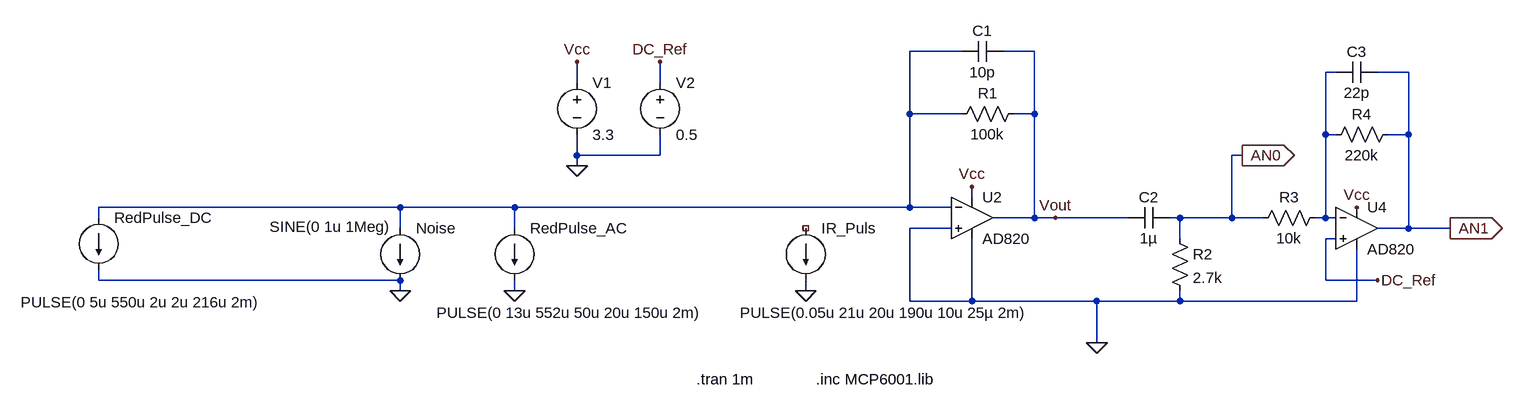
[diagram p0: schematic Verstärkerstufe.asc]
Verstärkerstufe.asc, the LTspice schematic file:
Version 4
SHEET 1 1632 680
WIRE 224 -64 144 -64
WIRE 336 -64 288 -64
WIRE 800 -32 784 -32
WIRE 912 -32 864 -32
WIRE -368 -16 -368 -48
WIRE -240 -16 -240 -48
WIRE 144 32 144 -64
WIRE 224 32 144 32
WIRE 336 32 336 -64
WIRE 336 32 304 32
WIRE 784 64 784 -32
WIRE 800 64 784 64
WIRE 912 64 912 -32
WIRE 912 64 880 64
WIRE -368 96 -368 64
WIRE -240 96 -240 64
WIRE -240 96 -368 96
WIRE 656 96 640 96
WIRE -368 112 -368 96
WIRE 240 160 240 144
WIRE -640 176 -1104 176
WIRE -464 176 -640 176
WIRE 144 176 144 32
WIRE 144 176 -464 176
WIRE 208 176 144 176
WIRE -1104 192 -1104 176
WIRE 336 192 336 32
WIRE 336 192 272 192
WIRE 368 192 336 192
WIRE 480 192 368 192
WIRE 560 192 544 192
WIRE 640 192 640 96
WIRE 640 192 560 192
WIRE 688 192 640 192
WIRE 784 192 784 64
WIRE 784 192 768 192
WIRE 800 192 784 192
WIRE -640 208 -640 176
WIRE -464 208 -464 176
WIRE 208 208 144 208
WIRE 912 208 912 64
WIRE 912 208 864 208
WIRE 976 208 912 208
WIRE 560 224 560 192
WIRE 800 224 784 224
WIRE -1104 288 -1104 272
WIRE -640 288 -1104 288
WIRE 784 288 784 224
WIRE 864 288 784 288
WIRE -640 304 -640 288
WIRE -464 304 -464 288
WIRE -16 304 -16 288
WIRE 144 320 144 208
WIRE 240 320 240 224
WIRE 240 320 144 320
WIRE 432 320 240 320
WIRE 560 320 560 304
WIRE 560 320 432 320
WIRE 832 320 832 240
WIRE 832 320 560 320
WIRE 432 384 432 320
FLAG -368 112 0
FLAG -368 -48 Vcc
FLAG 240 144 Vcc
FLAG -464 304 0
FLAG -16 304 0
FLAG 368 192 Vout
FLAG -640 304 0
FLAG 432 384 0
FLAG 832 176 Vcc
FLAG 976 208 AN1
IOPIN 976 208 Out
FLAG 656 96 AN0
IOPIN 656 96 Out
FLAG -240 -48 DC_Ref
FLAG 864 288 DC_Ref
SYMBOL voltage -368 -32 R0
WINDOW 123 0 0 Left 0
WINDOW 39 0 0 Left 0
SYMATTR InstName V1
SYMATTR Value 3.3
SYMBOL res 320 16 R90
WINDOW 0 0 56 VBottom 2
WINDOW 3 32 56 VTop 2
SYMATTR InstName R1
SYMATTR Value 100k
SYMBOL current -16 208 R0
WINDOW 123 0 0 Left 0
WINDOW 39 0 0 Left 0
WINDOW 3 -101 130 Left 2
SYMATTR Value PULSE(0.05u 21u 20u 190u 10u 25µ 2m)
SYMATTR InstName IR_Puls
SYMBOL current -464 208 R0
WINDOW 3 -120 130 Left 2
WINDOW 123 0 0 Left 0
WINDOW 39 0 0 Left 0
SYMATTR Value PULSE(0 13u 552u 50u 20u 150u 2m)
SYMATTR InstName RedPulse_AC
SYMBOL current -640 208 R0
WINDOW 3 -201 -2 Left 2
WINDOW 123 24 108 Left 2
WINDOW 39 0 0 Left 0
SYMATTR Value SINE(0 1u 1Meg)
SYMATTR InstName Noise
SYMBOL cap 544 176 R90
WINDOW 0 0 32 VBottom 2
WINDOW 3 32 32 VTop 2
SYMATTR InstName C2
SYMATTR Value 1µ
SYMBOL res 544 208 R0
SYMATTR InstName R2
SYMATTR Value 2.7k
SYMBOL res 784 176 R90
WINDOW 0 0 56 VBottom 2
WINDOW 3 32 56 VTop 2
SYMATTR InstName R3
SYMATTR Value 10k
SYMBOL res 896 48 R90
WINDOW 0 0 56 VBottom 2
WINDOW 3 32 56 VTop 2
SYMATTR InstName R4
SYMATTR Value 220k
SYMBOL cap 864 -48 R90
WINDOW 0 0 32 VBottom 2
WINDOW 3 32 32 VTop 2
SYMATTR InstName C3
SYMATTR Value 22p
SYMBOL voltage -240 -32 R0
WINDOW 123 0 0 Left 0
WINDOW 39 0 0 Left 0
SYMATTR InstName V2
SYMATTR Value 0.5
SYMBOL cap 224 -48 R270
WINDOW 0 32 32 VTop 2
WINDOW 3 0 32 VBottom 2
SYMATTR InstName C1
SYMATTR Value 10p
SYMBOL OpAmps\\AD820 240 128 R0
SYMATTR InstName U2
SYMBOL OpAmps\\AD820 832 144 R0
SYMATTR InstName U4
SYMBOL current -1104 192 R0
WINDOW 3 -120 130 Left 2
WINDOW 123 0 0 Left 0
WINDOW 39 0 0 Left 0
SYMATTR Value PULSE(0 5u 550u 2u 2u 216u 2m)
SYMATTR InstName RedPulse_DC
TEXT -184 440 Left 2 !.tran 1m
TEXT 0 440 Left 2 !.inc MCP6001.lib

The netlist it stands for:
* Verstärkerstufe.asc
V1 Vcc 0 3.3
R1 Vout N001 100k
IR_Puls NC_01 0 PULSE(0.05u 21u 20u 190u 10u 25µ 2m)
I§RedPulse_AC N001 0 PULSE(0 13u 552u 50u 20u 150u 2m)
I§Noise N001 0 SINE(0 1u 1Meg)
C2 AN0 Vout 1µ
R2 AN0 0 2.7k
R3 N002 AN0 10k
R4 AN1 N002 220k
C3 AN1 N002 22p
V2 DC_Ref 0 0.5
C1 N001 Vout 10p
XU2 0 N001 Vcc 0 Vout AD820  ; pins In+ In- V+ V- OUT
XU4 DC_Ref N002 Vcc 0 AN1 AD820  ; pins In+ In- V+ V- OUT
I§RedPulse_DC N001 0 PULSE(0 5u 550u 2u 2u 216u 2m)
.tran 1m
.inc MCP6001.lib
.backanno
.end